# Altium schematic sheet Sheet.SchDoc
size A; SheetNumber: 1; SheetTotal: 1
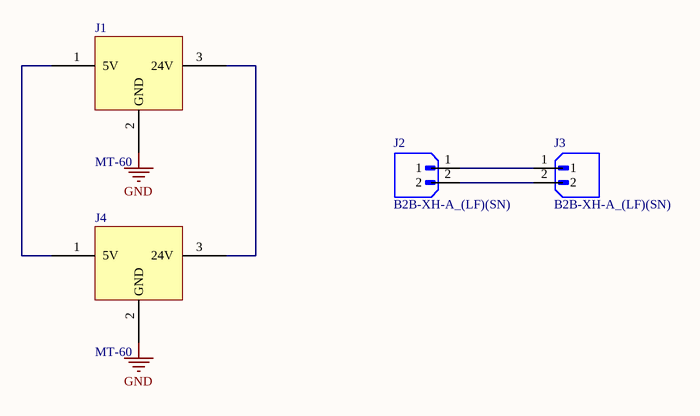
[diagram p0: Sheet.SchDoc]

## Parts
J1  MT-60  [MT-60]
J2  B2B-XH-A_(LF)(SN)  [JST_B2B-XH-A_(LF)(SN)]
J3  B2B-XH-A_(LF)(SN)  [JST_B2B-XH-A_(LF)(SN)]
J4  MT-60  [MT-60]

## Nets
GND: J1.2(GND) J4.2(GND)
NetJ1_1: J1.1(5V) J4.1(5V)
NetJ1_3: J1.3(24V) J4.3(24V)
NetJ2_1: J2.1 J3.1
NetJ2_2: J2.2 J3.2

## Library data of the parts
J2 J3 = B2B-XH-A_(LF)(SN): Connector Header Through Hole 2 position 0.098 (2.50mm); MF: JST Sales; MP: B2B-XH-A (LF)(SN); SnapEDA_Link: https://www.snapeda.com/parts/B2B-XH-A%20(LF)(SN)/JST+Sales+America+Inc./view-part/?ref=snap; Package: None; Value: *; Check_prices: https://www.snapeda.com/parts/B2B-XH-A%20(LF)(SN)/JST+Sales+America+Inc./view-part/?ref=eda; LCSC part #: C19271386
J1 J4 = MT-60: LCSC part #: C99176